# Altium schematic sheet Controllers.SchDoc: Payload Card Output Control
size A3; Revision: 1A; SheetNumber: 3; SheetTotal: 7; Organization: Brickworks; Address1: Matthew Glazer; Address2: Design Engineer
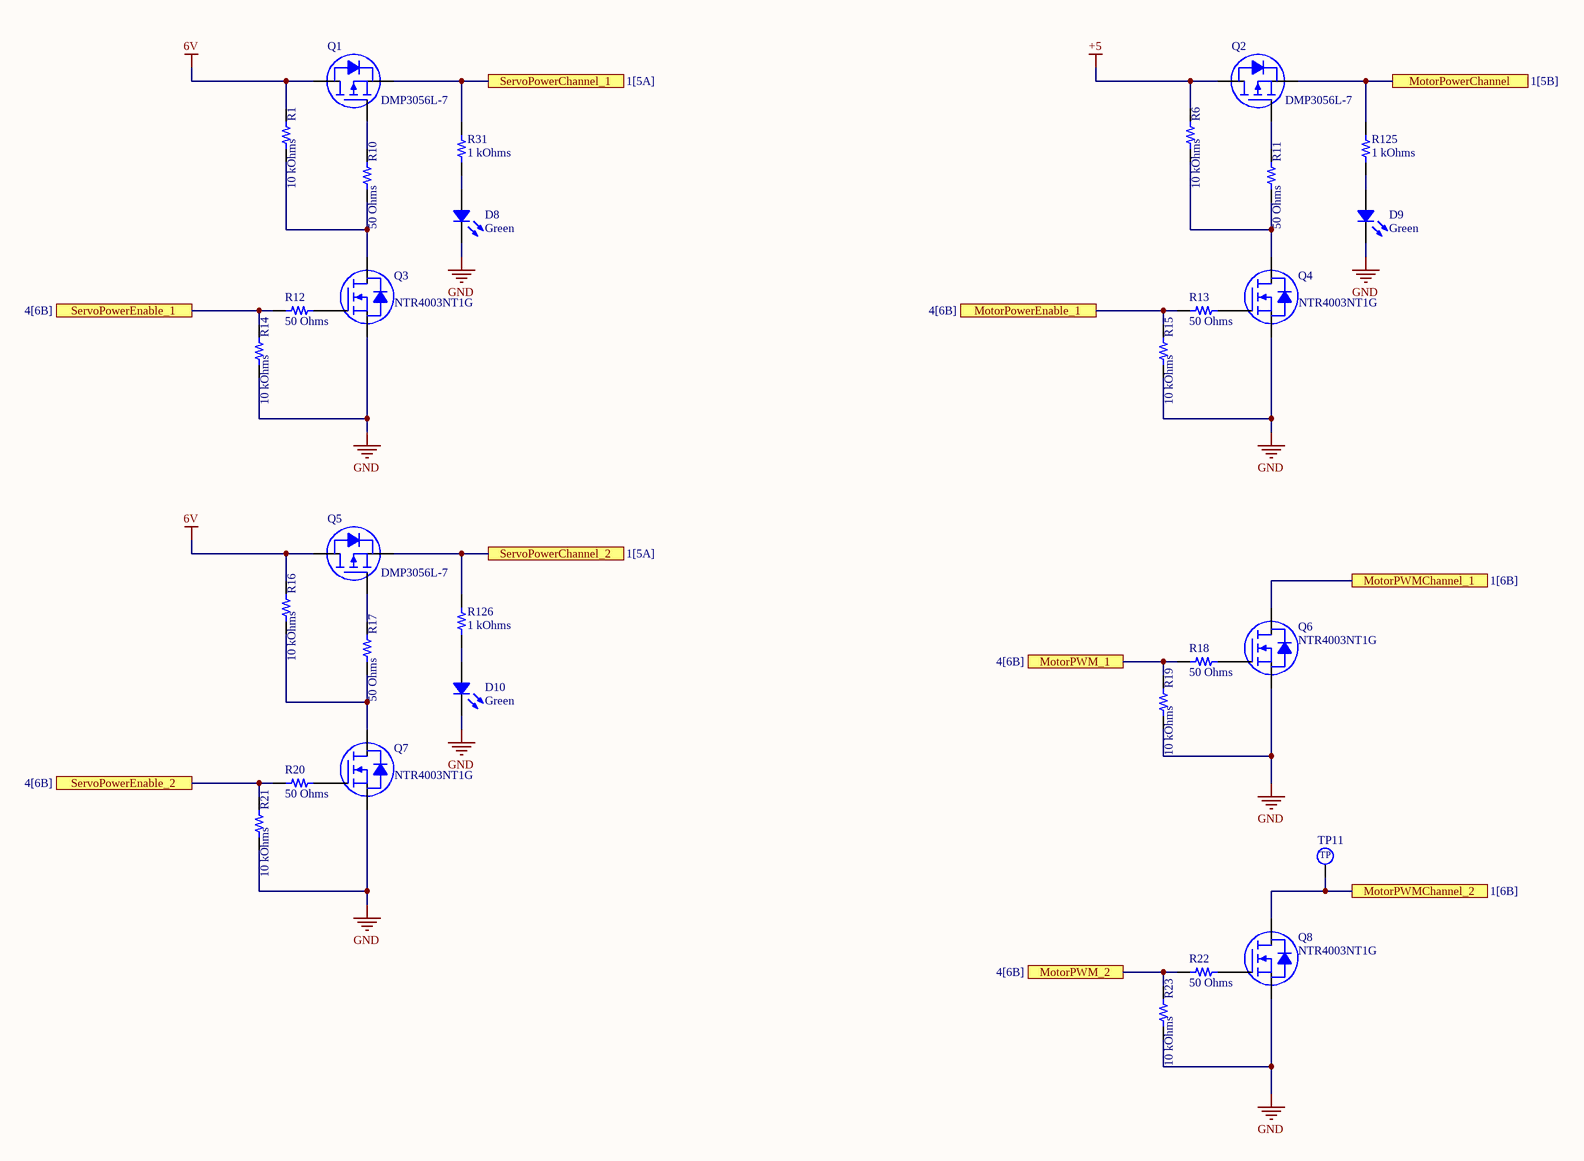
[diagram p0: Controllers.SchDoc]

## Parts
D8  Green  [LED 0603_1608 GREEN]
D9  Green  [LED 0603_1608 GREEN]
D10  Green  [LED 0603_1608 GREEN]
Q1  DMP3056L-7  [DIODES SOT-23-3]
Q2  DMP3056L-7  [DIODES SOT-23-3]
Q3  NTR4003NT1G  [ON SEMI SOT-23-3]
Q4  NTR4003NT1G  [ON SEMI SOT-23-3]
Q5  DMP3056L-7  [DIODES SOT-23-3]
Q6  NTR4003NT1G  [ON SEMI SOT-23-3]
Q7  NTR4003NT1G  [ON SEMI SOT-23-3]
Q8  NTR4003NT1G  [ON SEMI SOT-23-3]
R1  10 kOhms  [RES 0603_1608]
R6  10 kOhms  [RES 0603_1608]
R10  50 Ohms  [RES 0603_1608]
R11  50 Ohms  [RES 0603_1608]
R12  50 Ohms  [RES 0603_1608]
R13  50 Ohms  [RES 0603_1608]
R14  10 kOhms  [RES 0603_1608]
R15  10 kOhms  [RES 0603_1608]
R16  10 kOhms  [RES 0603_1608]
R17  50 Ohms  [RES 0603_1608]
R18  50 Ohms  [RES 0603_1608]
R19  10 kOhms  [RES 0603_1608]
R20  50 Ohms  [RES 0603_1608]
R21  10 kOhms  [RES 0603_1608]
R22  50 Ohms  [RES 0603_1608]
R23  10 kOhms  [RES 0603_1608]
R31  1 kOhms  [RES 0603_1608]
R125  1 kOhms  [RES 0603_1608]
R126  1 kOhms  [RES 0603_1608]
TP11  2.5mm_SMD_TestPoint  [2.5mm TestPoint]  (value not drawn)

## Ports
MotorPowerChannel (see 1[5B]), MotorPowerEnable_1 (see 4[6B]), MotorPWM_1 (see 4[6B]), MotorPWM_2 (see 4[6B]), MotorPWMChannel_1 (see 1[6B]), MotorPWMChannel_2 (see 1[6B]), ServoPowerChannel_1 (see 1[5A]), ServoPowerChannel_2 (see 1[5A]), ServoPowerEnable_1 (see 4[6B]), ServoPowerEnable_2 (see 4[6B])

## Nets
6V: Q1.3(D) Q5.3(D) R1.2 R16.2
+5: Q2.3(D) R6.2
GND: D8.2 D9.2 D10.2 Q3.2(S) Q4.2(S) Q6.2(S) Q7.2(S) Q8.2(S) R14.1 R15.1 R19.1 R21.1 R23.1
MotorPowerChannel: Q2.2(S) R125.2 ; port MotorPowerChannel
MotorPowerEnable_1: R13.2 R15.2 ; port MotorPowerEnable_1
MotorPWM_1: R18.2 R19.2 ; port MotorPWM_1
MotorPWM_2: R22.2 R23.2 ; port MotorPWM_2
MotorPWMChannel_1: Q6.3(D) ; port MotorPWMChannel_1
MotorPWMChannel_2: Q8.3(D) TP11.1 ; port MotorPWMChannel_2
ServoPowerChannel_1: Q1.2(S) R31.2 ; port ServoPowerChannel_1
ServoPowerChannel_2: Q5.2(S) R126.2 ; port ServoPowerChannel_2
ServoPowerEnable_1: R12.2 R14.2 ; port ServoPowerEnable_1
ServoPowerEnable_2: R20.2 R21.2 ; port ServoPowerEnable_2
NetD8_1: D8.1 R31.1
NetD9_1: D9.1 R125.1
NetD10_1: D10.1 R126.1
NetQ1_1: Q1.1(G) R10.2
NetQ2_1: Q2.1(G) R11.2
NetQ3_1: Q3.1(G) R12.1
NetQ3_3: Q3.3(D) R1.1 R10.1
NetQ4_1: Q4.1(G) R13.1
NetQ4_3: Q4.3(D) R6.1 R11.1
NetQ5_1: Q5.1(G) R17.2
NetQ6_1: Q6.1(G) R18.1
NetQ7_1: Q7.1(G) R20.1
NetQ7_3: Q7.3(D) R16.1 R17.1
NetQ8_1: Q8.1(G) R22.1

## Notes on the sheet
- Title
- Size:
- Date:
- A3
- Number:
- Time:
- Revision:
- Sheet
- of
- File:
- (in symbol 2.5mm_SMD_TestPoint) TP

## Library data of the parts
D8-D10 = LTST-C193KGKT-5A: LED GREEN CLEAR CHIP SMD; Manufacturer: Lite-On Inc.; Configuration: Standard; Current - Test: 5mA; Lens Color: Colorless; Lens Size: 1.15mm x 0.80mm; Lens Style: Rectangle with Flat Top; Millicandela Rating: 16.25mcd; Viewing Angle: 130°; Voltage - Forward (Vf) (Typ): 2V; Wavelength - Dominant: 572nm; Wavelength - Peak: 574nm; Part Number: LTST-C193KGKT-5A; Color: Green; ComponentLink1Description: Datasheet; ComponentLink1URL: http://optoelectronics.liteon.com/upload/download/DS22-2007-0094/LTST-C193KGKT-5A.PDF; ComponentLink2Description: DigiKey Link; ComponentLink2URL: http://digikey.com/product-detail/en/lite-on-inc/LTST-C193KGKT-5A/160-1828-1-ND/2356247; Device Package: 0603 (1608 Metric); Height (Max): 0.45mm; LastUpdated: 9/2/2020 1:20:41 AM; Lens Transparency: Clear; Lifecycle Status: Active; Minimum Order: 1; Mounting Type: Surface Mount; Package / Case: 0603 (1608 Metric); Packaging: TapeAndReel; PartId: 694; Part Status: Active; Price: 0.06; Series: -; Size / Dimension: 1.60mm L x 0.80mm W; Supplier 1: DigiKey; Supplier Part Number 1: 160-1828-1-ND; Supplier Device Package: Chip LED; Value: Green
Q1 Q2 Q5 = DMP3056L-7: MOSFET P-CH 30V 4.3A SOT23; Manufacturer: Diodes Incorporated; Current - Continuous Drain (Id) @ 25°C: 4.3A (Ta); Drive Voltage (Max Rds On,  Min Rds On): 4.5V, 10V; FET Type: P-Channel; Gate Charge (Qg) (Max) @ Vgs: 11.8nC @ 10V; Input Capacitance (Ciss) (Max) @ Vds: 642pF @ 25V; Power Dissipation (Max): 1.38W (Ta); Rds On (Max) @ Id, Vgs: 50mOhm @ 6A, 10V; Vgs (Max): ±25V; Vgs(th) (Max) @ Id: 2.1V @ 250µA; Part Number: DMP3056L-7; ComponentLink1Description: Datasheet; ComponentLink1URL: https://www.diodes.com/assets/Datasheets/DMP3056L.pdf; ComponentLink2Description: DigiKey Link; ComponentLink2URL: http://digikey.com/product-detail/en/diodes-incorporated/DMP3056L-7/DMP3056L-7DICT-ND/5126873; Drain to Source Voltage (Vdss): 30V; LastUpdated: 9/2/2020 1:25:04 AM; Lifecycle Status: Active; Minimum Order: 1; Mounting Type: Surface Mount; Operating Temperature: -55°C ~ 150°C (TJ); Package / Case: TO-236-3, SC-59, SOT-23-3; Packaging: TapeAndReel; Part Status: Active; Price: 0.11; Series: -; Supplier 1: DigiKey; Supplier Part Number 1: DMP3056L-7DICT-ND; Supplier Device Package: SOT-23; Technology: MOSFET (Metal Oxide)
Q3 Q4 Q6-Q8 = NTR4003NT1G: MOSFET N-CH 30V 500MA SOT-23; Manufacturer: ON Semiconductor; Current - Continuous Drain (Id) @ 25°C: 500mA (Ta); Drive Voltage (Max Rds On,  Min Rds On): 2.5V, 4V; FET Type: N-Channel; Gate Charge (Qg) (Max) @ Vgs: 1.15nC @ 5V; Input Capacitance (Ciss) (Max) @ Vds: 21pF @ 5V; Power Dissipation (Max): 690mW (Ta); Rds On (Max) @ Id, Vgs: 1.5Ohm @ 10mA, 4V; Vgs (Max): ±20V; Vgs(th) (Max) @ Id: 1.4V @ 250µA; Part Number: NTR4003NT1G; ComponentLink1Description: Datasheet; ComponentLink1URL: http://www.onsemi.com/pub/Collateral/NTR4003N-D.PDF; ComponentLink2Description: DigiKey Link; ComponentLink2URL: http://digikey.com/product-detail/en/on-semiconductor/NTR4003NT1G/NTR4003NT1GOSCT-ND/1967270; Drain to Source Voltage (Vdss): 30V; LastUpdated: 9/2/2020 1:25:08 AM; Lifecycle Status: Active; Minimum Order: 1; Mounting Type: Surface Mount; Operating Temperature: -55°C ~ 150°C (TJ); Package / Case: TO-236-3, SC-59, SOT-23-3; Packaging: TapeAndReel; Part Status: Active; Price: 0.05; Series: -; Supplier 1: DigiKey; Supplier Part Number 1: NTR4003NT1GOSCT-ND; Supplier Device Package: SOT-23-3 (TO-236); Technology: MOSFET (Metal Oxide)
R1 R6 R14-R16 R19 R21 R23 = RMCF0603JT10K0: RES 10K OHM 5% 1/10W 0603; Manufacturer: Stackpole Electronics Inc; Power (Watts): 0.1W, 1/10W; Temperature Coefficient: ±200ppm/°C; Part Number: RMCF0603JT10K0; Value: 10 kOhms; ComponentLink1Description: Datasheet; ComponentLink1URL: https://www.seielect.com/catalog/sei-packaging.pdf; ComponentLink2Description: DigiKey Link; ComponentLink2URL: http://digikey.com/product-detail/en/stackpole-electronics-inc/RMCF0603JT10K0/RMCF0603JT10K0CT-ND/1943191; Composition: Thick Film; Device Package: 0603 (1608 Metric); Features: Automotive AEC-Q200; Height - Seated (Max): 0.022" (0.55mm); LastUpdated: 8/30/2020 8:48:45 PM; Lifecycle Status: Active; Minimum Order: 1; Number of Terminations: 2; Operating Temperature: -55°C ~ 155°C; Package / Case: 0603 (1608 Metric); Packaging: CutTape; PartId: 25659; Part Status: Active; Price: 0.10; Ratings: AEC-Q200; Resistance: 10 kOhms; Series: RMCF; Size / Dimension: 0.061" L x 0.031" W (1.55mm x 0.80mm); Supplier 1: DigiKey; Supplier Part Number 1: RMCF0603JT10K0CT-ND; Supplier Device Package: 0603; Tolerance: ±5%
R10-R13 R17 R18 R20 R22 = CRCW060350R0FKEA: RES SMD 50 OHM 1% 1/10W 0603; Manufacturer: Vishay Dale; Power (Watts): 0.1W, 1/10W; Temperature Coefficient: ±100ppm/°C; Part Number: CRCW060350R0FKEA; Value: 50 Ohms; ComponentLink1Description: Datasheet; ComponentLink1URL: http://www.vishay.com/docs/20035/dcrcwe3.pdf; ComponentLink2Description: DigiKey Link; ComponentLink2URL: http://digikey.com/product-detail/en/vishay-dale/CRCW060350R0FKEA/541-3318-1-ND/6684924; Composition: Thick Film; Device Package: 0603 (1608 Metric); Features: Automotive AEC-Q200; Height - Seated (Max): 0.020" (0.50mm); LastUpdated: 9/2/2020 1:09:40 AM; Lifecycle Status: Active; Minimum Order: 1; Number of Terminations: 2; Operating Temperature: -55°C ~ 155°C; Package / Case: 0603 (1608 Metric); Packaging: CutTape; PartId: 23780; Part Status: Active; Price: 0.10; Ratings: AEC-Q200; Resistance: 50 Ohms; Series: CRCW; Size / Dimension: 0.061" L x 0.033" W (1.55mm x 0.85mm); Supplier 1: DigiKey; Supplier Part Number 1: 541-3318-1-ND; Supplier Device Package: 0603; Tolerance: ±1%
R31 R125 R126 = RNCP0603FTD1K00: RES 1K OHM 1% 1/8W 0603; Manufacturer: Stackpole Electronics Inc; Power (Watts): 0.125W, 1/8W; Temperature Coefficient: ±100ppm/°C; Part Number: RNCP0603FTD1K00; Value: 1 kOhms; ComponentLink1Description: Datasheet; ComponentLink1URL: https://www.seielect.com/catalog/sei-rncp.pdf; ComponentLink2Description: DigiKey Link; ComponentLink2URL: http://digikey.com/product-detail/en/stackpole-electronics-inc/RNCP0603FTD1K00/RNCP0603FTD1K00CT-ND/2240445; Composition: Thin Film; Device Package: 0603 (1608 Metric); Features: Anti-Sulfur, Moisture Resistant; Height - Seated (Max): 0.020" (0.50mm); LastUpdated: 9/2/2020 1:10:23 AM; Lifecycle Status: Active; Minimum Order: 1; Number of Terminations: 2; Operating Temperature: -55°C ~ 155°C; Package / Case: 0603 (1608 Metric); Packaging: TapeAndReel; PartId: 5694; Part Status: Active; Price: 0.01; Resistance: 1 kOhms; Series: RNCP; Size / Dimension: 0.059" L x 0.031" W (1.50mm x 0.80mm); Supplier 1: DigiKey; Supplier Part Number 1: RNCP0603FTD1K00CT-ND; Supplier Device Package: 0603; Tolerance: ±1%